# EAGLE design Cube-Panel (EAGLE 7.7.0)
Assembly variants: P1, P2, P3, P4, P5, P6
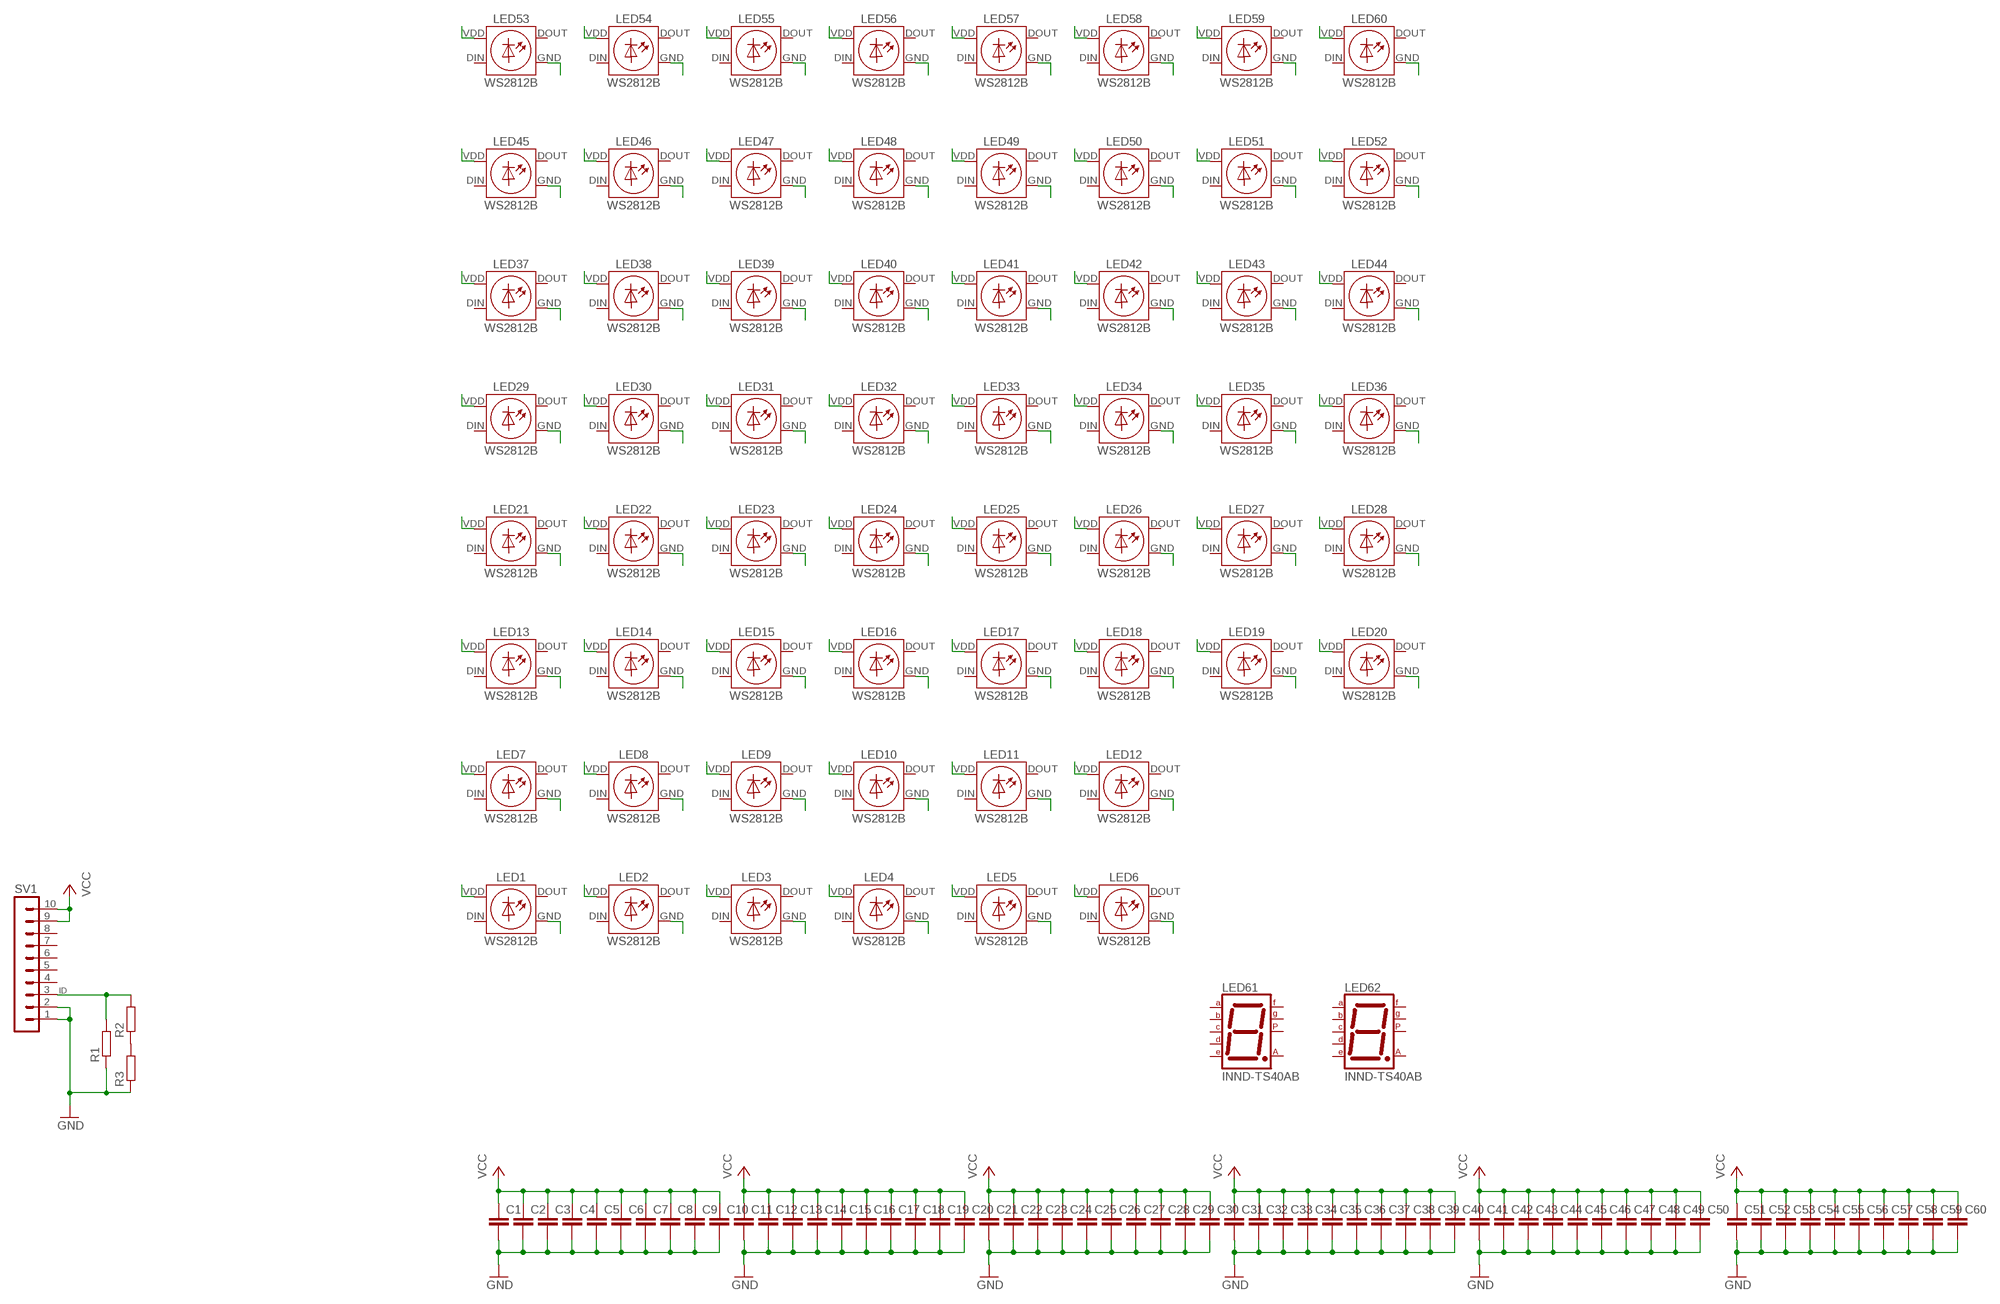
[diagram p0: schematic, sheet 1]

## Parts
C1  KONDENSATOR-0603  [0603]
C2  KONDENSATOR-0603  [0603]
C3  KONDENSATOR-0603  [0603]
C4  KONDENSATOR-0603  [0603]
C5  KONDENSATOR-0603  [0603]
C6  KONDENSATOR-0603  [0603]
C7  KONDENSATOR-0603  [0603]
C8  KONDENSATOR-0603  [0603]
C9  KONDENSATOR-0603  [0603]
C10  KONDENSATOR-0603  [0603]
C11  KONDENSATOR-0603  [0603]
C12  KONDENSATOR-0603  [0603]
C13  KONDENSATOR-0603  [0603]
C14  KONDENSATOR-0603  [0603]
C15  KONDENSATOR-0603  [0603]
C16  KONDENSATOR-0603  [0603]
C17  KONDENSATOR-0603  [0603]
C18  KONDENSATOR-0603  [0603]
C19  KONDENSATOR-0603  [0603]
C20  KONDENSATOR-0603  [0603]
C21  KONDENSATOR-0603  [0603]
C22  KONDENSATOR-0603  [0603]
C23  KONDENSATOR-0603  [0603]
C24  KONDENSATOR-0603  [0603]
C25  KONDENSATOR-0603  [0603]
C26  KONDENSATOR-0603  [0603]
C27  KONDENSATOR-0603  [0603]
C28  KONDENSATOR-0603  [0603]
C29  KONDENSATOR-0603  [0603]
C30  KONDENSATOR-0603  [0603]
C31  KONDENSATOR-0603  [0603]
C32  KONDENSATOR-0603  [0603]
C33  KONDENSATOR-0603  [0603]
C34  KONDENSATOR-0603  [0603]
C35  KONDENSATOR-0603  [0603]
C36  KONDENSATOR-0603  [0603]
C37  KONDENSATOR-0603  [0603]
C38  KONDENSATOR-0603  [0603]
C39  KONDENSATOR-0603  [0603]
C40  KONDENSATOR-0603  [0603]
C41  KONDENSATOR-0603  [0603]
C42  KONDENSATOR-0603  [0603]
C43  KONDENSATOR-0603  [0603]
C44  KONDENSATOR-0603  [0603]
C45  KONDENSATOR-0603  [0603]
C46  KONDENSATOR-0603  [0603]
C47  KONDENSATOR-0603  [0603]
C48  KONDENSATOR-0603  [0603]
C49  KONDENSATOR-0603  [0603]
C50  KONDENSATOR-0603  [0603]
C51  KONDENSATOR-0603  [0603]
C52  KONDENSATOR-0603  [0603]
C53  KONDENSATOR-0603  [0603]
C54  KONDENSATOR-0603  [0603]
C55  KONDENSATOR-0603  [0603]
C56  KONDENSATOR-0603  [0603]
C57  KONDENSATOR-0603  [0603]
C58  KONDENSATOR-0603  [0603]
C59  KONDENSATOR-0603  [0603]
C60  KONDENSATOR-0603  [0603]
LED1  WS2812B  [WS2812B]  (not fitted in variant P1)  (not fitted in variant P2)  (not fitted in variant P3)  (not fitted in variant P4)  (not fitted in variant P5)  (not fitted in variant P6)
LED2  WS2812B  [WS2812B]  (not fitted in variant P1)  (not fitted in variant P2)  (not fitted in variant P3)  (not fitted in variant P4)  (not fitted in variant P5)  (not fitted in variant P6)
LED3  WS2812B  [WS2812B]  (not fitted in variant P1)  (not fitted in variant P2)  (not fitted in variant P5)  (not fitted in variant P6)  (not fitted in variant P4)
LED4  WS2812B  [WS2812B]  (not fitted in variant P1)  (not fitted in variant P2)  (not fitted in variant P3)  (not fitted in variant P4)  (not fitted in variant P5)  (not fitted in variant P6)
LED5  WS2812B  [WS2812B]  (not fitted in variant P1)  (not fitted in variant P2)  (not fitted in variant P3)  (not fitted in variant P6)
LED6  WS2812B  [WS2812B]  (not fitted in variant P1)  (not fitted in variant P2)  (not fitted in variant P3)  (not fitted in variant P4)  (not fitted in variant P5)  (not fitted in variant P6)
LED7  WS2812B  [WS2812B]  (not fitted in variant P1)  (not fitted in variant P2)  (not fitted in variant P3)  (not fitted in variant P4)  (not fitted in variant P5)  (not fitted in variant P6)
LED8  WS2812B  [WS2812B]  (not fitted in variant P1)  (not fitted in variant P2)  (not fitted in variant P3)  (not fitted in variant P4)  (not fitted in variant P5)  (not fitted in variant P6)
LED9  WS2812B  [WS2812B]  (not fitted in variant P1)  (not fitted in variant P2)  (not fitted in variant P5)  (not fitted in variant P6)  (not fitted in variant P4)
LED10  WS2812B  [WS2812B]  (not fitted in variant P1)  (not fitted in variant P2)  (not fitted in variant P3)  (not fitted in variant P4)  (not fitted in variant P5)  (not fitted in variant P6)
LED11  WS2812B  [WS2812B]  (not fitted in variant P1)  (not fitted in variant P2)  (not fitted in variant P3)  (not fitted in variant P6)
LED12  WS2812B  [WS2812B]  (not fitted in variant P1)  (not fitted in variant P2)  (not fitted in variant P3)  (not fitted in variant P4)  (not fitted in variant P5)  (not fitted in variant P6)
LED13  WS2812B  [WS2812B]  (not fitted in variant P1)  (not fitted in variant P3)  (not fitted in variant P4)  (not fitted in variant P5)  (not fitted in variant P6)
LED14  WS2812B  [WS2812B]  (not fitted in variant P1)  (not fitted in variant P3)  (not fitted in variant P4)  (not fitted in variant P5)  (not fitted in variant P6)
LED15  WS2812B  [WS2812B]  (not fitted in variant P1)  (not fitted in variant P5)  (not fitted in variant P6)  (not fitted in variant P4)
LED16  WS2812B  [WS2812B]  (not fitted in variant P1)  (not fitted in variant P5)  (not fitted in variant P6)  (not fitted in variant P4)
LED17  WS2812B  [WS2812B]  (not fitted in variant P1)  (not fitted in variant P6)
LED18  WS2812B  [WS2812B]  (not fitted in variant P2)  (not fitted in variant P3)  (not fitted in variant P4)  (not fitted in variant P5)  (not fitted in variant P6)
LED19  WS2812B  [WS2812B]  (not fitted in variant P2)  (not fitted in variant P3)  (not fitted in variant P4)  (not fitted in variant P5)  (not fitted in variant P6)
LED20  WS2812B  [WS2812B]  (not fitted in variant P2)  (not fitted in variant P3)  (not fitted in variant P4)  (not fitted in variant P5)  (not fitted in variant P6)
LED21  WS2812B  [WS2812B]  (not fitted in variant P1)  (not fitted in variant P2)  (not fitted in variant P3)  (not fitted in variant P4)  (not fitted in variant P6)
LED22  WS2812B  [WS2812B]  (not fitted in variant P1)  (not fitted in variant P2)  (not fitted in variant P3)  (not fitted in variant P4)
LED23  WS2812B  [WS2812B]  (not fitted in variant P1)  (not fitted in variant P2)  (not fitted in variant P3)  (not fitted in variant P4)  (not fitted in variant P5)
LED24  WS2812B  [WS2812B]  (not fitted in variant P1)  (not fitted in variant P2)  (not fitted in variant P3)  (not fitted in variant P4)  (not fitted in variant P5)
LED25  WS2812B  [WS2812B]  (not fitted in variant P1)
LED26  WS2812B  [WS2812B]  (not fitted in variant P2)  (not fitted in variant P3)  (not fitted in variant P5)
LED27  WS2812B  [WS2812B]  (not fitted in variant P1)  (not fitted in variant P2)  (not fitted in variant P3)  (not fitted in variant P5)
LED28  WS2812B  [WS2812B]  (not fitted in variant P1)  (not fitted in variant P2)  (not fitted in variant P3)  (not fitted in variant P5)
LED29  WS2812B  [WS2812B]  (not fitted in variant P2)  (not fitted in variant P3)  (not fitted in variant P5)  (not fitted in variant P6)  (not fitted in variant P4)
LED30  WS2812B  [WS2812B]  (not fitted in variant P2)  (not fitted in variant P3)  (not fitted in variant P4)
LED31  WS2812B  [WS2812B]  (not fitted in variant P2)  (not fitted in variant P3)  (not fitted in variant P4)  (not fitted in variant P5)  (not fitted in variant P6)
LED32  WS2812B  [WS2812B]  (not fitted in variant P2)  (not fitted in variant P3)  (not fitted in variant P4)  (not fitted in variant P5)  (not fitted in variant P6)
LED33  WS2812B  [WS2812B]  (not fitted in variant P6)  (not fitted in variant P4)
LED34  WS2812B  [WS2812B]  (not fitted in variant P2)  (not fitted in variant P3)  (not fitted in variant P4)  (not fitted in variant P5)  (not fitted in variant P6)
LED35  WS2812B  [WS2812B]  (not fitted in variant P1)  (not fitted in variant P2)  (not fitted in variant P3)  (not fitted in variant P4)  (not fitted in variant P5)  (not fitted in variant P6)
LED36  WS2812B  [WS2812B]  (not fitted in variant P1)  (not fitted in variant P2)  (not fitted in variant P3)  (not fitted in variant P4)  (not fitted in variant P5)  (not fitted in variant P6)
LED37  WS2812B  [WS2812B]  (not fitted in variant P1)  (not fitted in variant P2)  (not fitted in variant P3)  (not fitted in variant P4)  (not fitted in variant P5)  (not fitted in variant P6)
LED38  WS2812B  [WS2812B]  (not fitted in variant P1)  (not fitted in variant P2)  (not fitted in variant P3)  (not fitted in variant P4)
LED39  WS2812B  [WS2812B]  (not fitted in variant P1)  (not fitted in variant P5)  (not fitted in variant P4)  (not fitted in variant P3)
LED40  WS2812B  [WS2812B]  (not fitted in variant P1)  (not fitted in variant P5)  (not fitted in variant P4)  (not fitted in variant P3)
LED41  WS2812B  [WS2812B]  (not fitted in variant P1)  (not fitted in variant P4)
LED42  WS2812B  [WS2812B]  (not fitted in variant P1)  (not fitted in variant P2)  (not fitted in variant P3)  (not fitted in variant P4)  (not fitted in variant P5)  (not fitted in variant P6)
LED43  WS2812B  [WS2812B]  (not fitted in variant P1)  (not fitted in variant P2)  (not fitted in variant P3)  (not fitted in variant P4)  (not fitted in variant P5)  (not fitted in variant P6)
LED44  WS2812B  [WS2812B]  (not fitted in variant P1)  (not fitted in variant P2)  (not fitted in variant P3)  (not fitted in variant P4)  (not fitted in variant P5)  (not fitted in variant P6)
LED45  WS2812B  [WS2812B]  (not fitted in variant P1)  (not fitted in variant P2)  (not fitted in variant P3)  (not fitted in variant P4)  (not fitted in variant P5)  (not fitted in variant P6)
LED46  WS2812B  [WS2812B]  (not fitted in variant P1)  (not fitted in variant P2)  (not fitted in variant P3)  (not fitted in variant P4)  (not fitted in variant P6)
LED47  WS2812B  [WS2812B]  (not fitted in variant P1)  (not fitted in variant P6)  (not fitted in variant P3)  (not fitted in variant P4)
LED48  WS2812B  [WS2812B]  (not fitted in variant P1)  (not fitted in variant P2)  (not fitted in variant P3)  (not fitted in variant P4)  (not fitted in variant P6)
LED49  WS2812B  [WS2812B]  (not fitted in variant P1)  (not fitted in variant P2)  (not fitted in variant P4)
LED50  WS2812B  [WS2812B]  (not fitted in variant P1)  (not fitted in variant P2)  (not fitted in variant P3)  (not fitted in variant P4)  (not fitted in variant P5)  (not fitted in variant P6)
LED51  WS2812B  [WS2812B]  (not fitted in variant P1)  (not fitted in variant P2)  (not fitted in variant P3)  (not fitted in variant P4)  (not fitted in variant P5)  (not fitted in variant P6)
LED52  WS2812B  [WS2812B]  (not fitted in variant P1)  (not fitted in variant P2)  (not fitted in variant P3)  (not fitted in variant P4)  (not fitted in variant P5)  (not fitted in variant P6)
LED53  WS2812B  [WS2812B]  (not fitted in variant P1)  (not fitted in variant P2)  (not fitted in variant P3)  (not fitted in variant P4)  (not fitted in variant P5)  (not fitted in variant P6)
LED54  WS2812B  [WS2812B]  (not fitted in variant P1)  (not fitted in variant P2)  (not fitted in variant P3)  (not fitted in variant P4)  (not fitted in variant P5)  (not fitted in variant P6)
LED55  WS2812B  [WS2812B]  (not fitted in variant P1)  (not fitted in variant P5)  (not fitted in variant P6)  (not fitted in variant P3)  (not fitted in variant P4)
LED56  WS2812B  [WS2812B]  (not fitted in variant P1)  (not fitted in variant P2)  (not fitted in variant P3)  (not fitted in variant P4)  (not fitted in variant P5)  (not fitted in variant P6)
LED57  WS2812B  [WS2812B]  (not fitted in variant P1)  (not fitted in variant P2)  (not fitted in variant P4)  (not fitted in variant P5)
LED58  WS2812B  [WS2812B]  (not fitted in variant P1)  (not fitted in variant P2)  (not fitted in variant P3)  (not fitted in variant P4)  (not fitted in variant P5)  (not fitted in variant P6)
LED59  WS2812B  [WS2812B]  (not fitted in variant P1)  (not fitted in variant P2)  (not fitted in variant P3)  (not fitted in variant P4)  (not fitted in variant P5)  (not fitted in variant P6)
LED60  WS2812B  [WS2812B]  (not fitted in variant P1)  (not fitted in variant P2)  (not fitted in variant P3)  (not fitted in variant P4)  (not fitted in variant P5)  (not fitted in variant P6)
LED61  INND-TS40AB  [7SEG-13]
LED62  INND-TS40AB  [7SEG-13]
R1  WIDERSTAND_0603  [R0603]
R2  WIDERSTAND_0603  [R0603]
R3  WIDERSTAND_0603  [R0603]
SV1  MA10-1  [MA10-1]

## Nets
GND: C1.P$2 C2.P$2 C3.P$2 C4.P$2 C5.P$2 C6.P$2 C7.P$2 C8.P$2 C9.P$2 C10.P$2 C11.P$2 C12.P$2 C13.P$2 C14.P$2 C15.P$2 C16.P$2 C17.P$2 C18.P$2 C19.P$2 C20.P$2 C21.P$2 C22.P$2 C23.P$2 C24.P$2 C25.P$2 C26.P$2 C27.P$2 C28.P$2 C29.P$2 C30.P$2 C31.P$2 C32.P$2 C33.P$2 C34.P$2 C35.P$2 C36.P$2 C37.P$2 C38.P$2 C39.P$2 C40.P$2 C41.P$2 C42.P$2 C43.P$2 C44.P$2 C45.P$2 C46.P$2 C47.P$2 C48.P$2 C49.P$2 C50.P$2 C51.P$2 C52.P$2 C53.P$2 C54.P$2 C55.P$2 C56.P$2 C57.P$2 C58.P$2 C59.P$2 C60.P$2 LED1.GND LED2.GND LED3.GND LED4.GND LED5.GND LED6.GND LED7.GND LED8.GND LED9.GND LED10.GND LED11.GND LED12.GND LED13.GND LED14.GND LED15.GND LED16.GND LED17.GND LED18.GND LED19.GND LED20.GND LED21.GND LED22.GND LED23.GND LED24.GND LED25.GND LED26.GND LED27.GND LED28.GND LED29.GND LED30.GND LED31.GND LED32.GND LED33.GND LED34.GND LED35.GND LED36.GND LED37.GND LED38.GND LED39.GND LED40.GND LED41.GND LED42.GND LED43.GND LED44.GND LED45.GND LED46.GND LED47.GND LED48.GND LED49.GND LED50.GND LED51.GND LED52.GND LED53.GND LED54.GND LED55.GND LED56.GND LED57.GND LED58.GND LED59.GND LED60.GND R1.1 R3.1 SV1.1 SV1.2
ID: R1.2 R2.2 SV1.3
N$1: R2.1 R3.2
VCC: C1.P$1 C2.P$1 C3.P$1 C4.P$1 C5.P$1 C6.P$1 C7.P$1 C8.P$1 C9.P$1 C10.P$1 C11.P$1 C12.P$1 C13.P$1 C14.P$1 C15.P$1 C16.P$1 C17.P$1 C18.P$1 C19.P$1 C20.P$1 C21.P$1 C22.P$1 C23.P$1 C24.P$1 C25.P$1 C26.P$1 C27.P$1 C28.P$1 C29.P$1 C30.P$1 C31.P$1 C32.P$1 C33.P$1 C34.P$1 C35.P$1 C36.P$1 C37.P$1 C38.P$1 C39.P$1 C40.P$1 C41.P$1 C42.P$1 C43.P$1 C44.P$1 C45.P$1 C46.P$1 C47.P$1 C48.P$1 C49.P$1 C50.P$1 C51.P$1 C52.P$1 C53.P$1 C54.P$1 C55.P$1 C56.P$1 C57.P$1 C58.P$1 C59.P$1 C60.P$1 LED1.VDD(VCC) LED2.VDD(VCC) LED3.VDD(VCC) LED4.VDD(VCC) LED5.VDD(VCC) LED6.VDD(VCC) LED7.VDD(VCC) LED8.VDD(VCC) LED9.VDD(VCC) LED10.VDD(VCC) LED11.VDD(VCC) LED12.VDD(VCC) LED13.VDD(VCC) LED14.VDD(VCC) LED15.VDD(VCC) LED16.VDD(VCC) LED17.VDD(VCC) LED18.VDD(VCC) LED19.VDD(VCC) LED20.VDD(VCC) LED21.VDD(VCC) LED22.VDD(VCC) LED23.VDD(VCC) LED24.VDD(VCC) LED25.VDD(VCC) LED26.VDD(VCC) LED27.VDD(VCC) LED28.VDD(VCC) LED29.VDD(VCC) LED30.VDD(VCC) LED31.VDD(VCC) LED32.VDD(VCC) LED33.VDD(VCC) LED34.VDD(VCC) LED35.VDD(VCC) LED36.VDD(VCC) LED37.VDD(VCC) LED38.VDD(VCC) LED39.VDD(VCC) LED40.VDD(VCC) LED41.VDD(VCC) LED42.VDD(VCC) LED43.VDD(VCC) LED44.VDD(VCC) LED45.VDD(VCC) LED46.VDD(VCC) LED47.VDD(VCC) LED48.VDD(VCC) LED49.VDD(VCC) LED50.VDD(VCC) LED51.VDD(VCC) LED52.VDD(VCC) LED53.VDD(VCC) LED54.VDD(VCC) LED55.VDD(VCC) LED56.VDD(VCC) LED57.VDD(VCC) LED58.VDD(VCC) LED59.VDD(VCC) LED60.VDD(VCC) SV1.9 SV1.10
Unconnected: LED1.DIN LED1.DOUT LED2.DIN LED2.DOUT LED3.DIN LED3.DOUT LED4.DIN LED4.DOUT LED5.DIN LED5.DOUT LED6.DIN LED6.DOUT LED7.DIN LED7.DOUT LED8.DIN LED8.DOUT LED9.DIN LED9.DOUT LED10.DIN LED10.DOUT LED11.DIN LED11.DOUT LED12.DIN LED12.DOUT LED13.DIN LED13.DOUT LED14.DIN LED14.DOUT LED15.DIN LED15.DOUT LED16.DIN LED16.DOUT LED17.DIN LED17.DOUT LED18.DIN LED18.DOUT LED19.DIN LED19.DOUT LED20.DIN LED20.DOUT LED21.DIN LED21.DOUT LED22.DIN LED22.DOUT LED23.DIN LED23.DOUT LED24.DIN LED24.DOUT LED25.DIN LED25.DOUT LED26.DIN LED26.DOUT LED27.DIN LED27.DOUT LED28.DIN LED28.DOUT LED29.DIN LED29.DOUT LED30.DIN LED30.DOUT LED31.DIN LED31.DOUT LED32.DIN LED32.DOUT LED33.DIN LED33.DOUT LED34.DIN LED34.DOUT LED35.DIN LED35.DOUT LED36.DIN LED36.DOUT LED37.DIN LED37.DOUT LED38.DIN LED38.DOUT LED39.DIN LED39.DOUT LED40.DIN LED40.DOUT LED41.DIN LED41.DOUT LED42.DIN LED42.DOUT LED43.DIN LED43.DOUT LED44.DIN LED44.DOUT LED45.DIN LED45.DOUT LED46.DIN LED46.DOUT LED47.DIN LED47.DOUT LED48.DIN LED48.DOUT LED49.DIN LED49.DOUT LED50.DIN LED50.DOUT LED51.DIN LED51.DOUT LED52.DIN LED52.DOUT LED53.DIN LED53.DOUT LED54.DIN LED54.DOUT LED55.DIN LED55.DOUT LED56.DIN LED56.DOUT LED57.DIN LED57.DOUT LED58.DIN LED58.DOUT LED59.DIN LED59.DOUT LED60.DIN LED60.DOUT LED61.1(E) LED61.2(F) LED61.3(G) LED61.5(D) LED61.6(CA2) LED61.7(DP) LED61.8(C) LED61.9(B) LED61.10(A) LED62.1(E) LED62.2(F) LED62.3(G) LED62.5(D) LED62.6(CA2) LED62.7(DP) LED62.8(C) LED62.9(B) LED62.10(A) SV1.4 SV1.5 SV1.6 SV1.7 SV1.8

## Library data of the parts
C1-C60 = _Passive:KONDENSATOR; PDP_NAME: Keramikkondensator, 0603, %VALUE%
LED1-LED60 = _LED:WS2812
LED61 LED62 = _LED:INND-TS40*AB
R1-R3 = _Passive:WIDERSTAND
SV1 = con-lstb:MA10-1: PIN HEADER; OC_FARNELL: unknown; OC_NEWARK: unknown

## Board
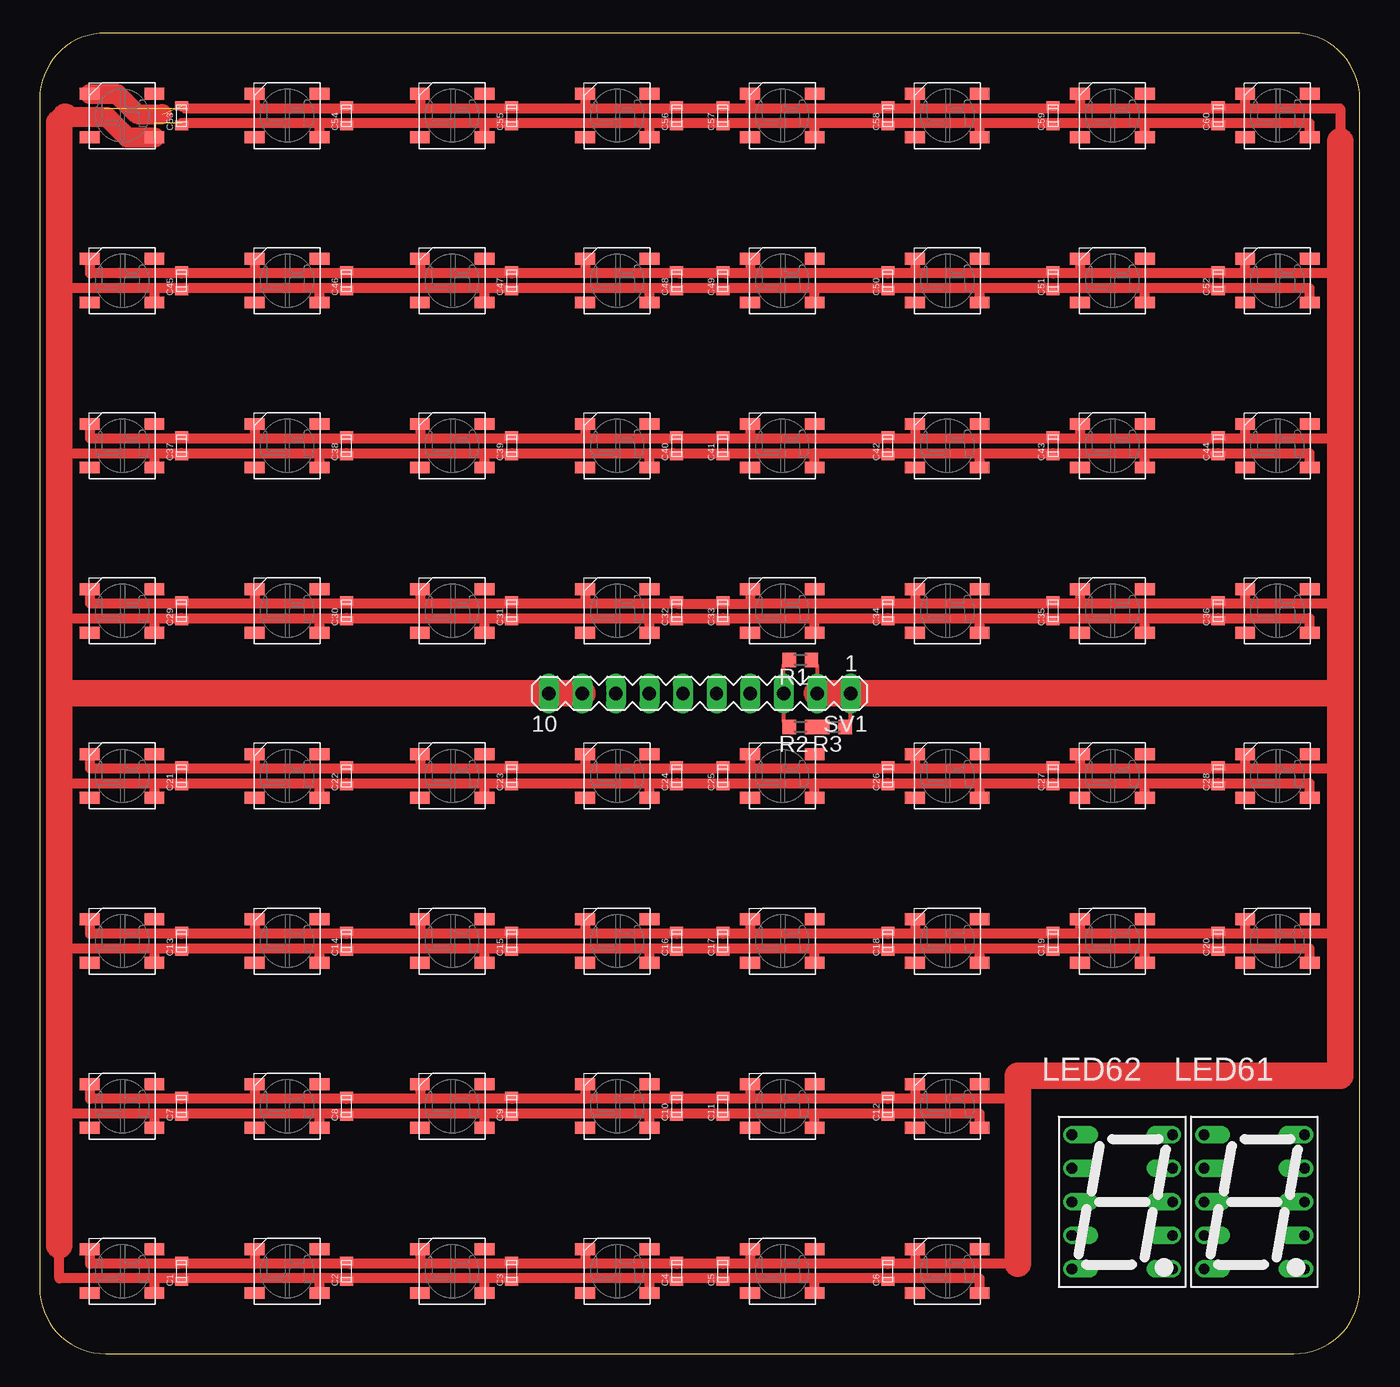
[diagram p1: board, top side]

Size 100 x 100 mm. Coordinates in mm from the lower left corner, seen from the top.
Outline: 5,0 95,0 arc90 100,5 100,95 arc90 95,100 5,100 arc90 0,95 0,5 arc90 5,0
Copper layers (1*16): Top 0.035mm / dielectric 1.5mm / Bottom 0.035mm
Design rules "default *": minimum track width 10mil, minimum drill 24mil, track to track 8mil, track to pad 8mil, pad to pad 8mil, via to via 8mil, smd to smd 8mil, copper to edge 0.5mm, drill to drill 8mil, minimum pad ring 10mil, minimum via ring 8mil, stop-mask expansion 4mil, vias tented up to drill 0mil, thermal gap 10mil

### Footprints (pad centres in the part's own frame; a part is rotated, then mirrored left to right if it is on the bottom)
0603 = smd 0.7 x 1: P$1 -0.75,0; P$2 0.75,0
WS2812B = smd 1.5 x 0.9: DIN 2.45,1.65; DOUT -2.45,-1.65; GND 2.45,-1.65; VDD -2.45,1.65
7SEG-13 = drill 0.813 offset: 1 -3.81,5.08; 2 -3.81,2.54; 3 -3.81,0; 4 -3.81,-2.54; 5 -3.81,-5.08; 6 3.81,-5.08; 7 3.81,-2.54; 8 3.81,0; 9 3.81,2.54; 10 3.81,5.08
R0603 = smd 1 x 1.1: 1 -0.85,0; 2 0.85,0
MA10-1 = drill 1.016 long: 1 -11.43,0; 2 -8.89,0; 3 -6.35,0; 4 -3.81,0; 5 -1.27,0; 6 1.27,0; 7 3.81,0; 8 6.35,0; 9 8.89,0; 10 11.43,0

### Placement (x,y rotation side)
C1  10.75,6.25 90 top
C2  23.25,6.25 90 top
C3  35.75,6.25 90 top
C4  48.25,6.25 90 top
C5  51.75,6.25 90 top
C6  64.25,6.25 90 top
C7  10.75,18.75 90 top
C8  23.25,18.75 90 top
C9  35.75,18.75 90 top
C10  48.25,18.75 90 top
C11  51.75,18.75 90 top
C12  64.25,18.75 90 top
C13  10.75,31.25 90 top
C14  23.25,31.25 90 top
C15  35.75,31.25 90 top
C16  48.25,31.25 90 top
C17  51.75,31.25 90 top
C18  64.25,31.25 90 top
C19  76.75,31.25 90 top
C20  89.25,31.25 90 top
C21  10.75,43.75 90 top
C22  23.25,43.75 90 top
C23  35.75,43.75 90 top
C24  48.25,43.75 90 top
C25  51.75,43.75 90 top
C26  64.25,43.75 90 top
C27  76.75,43.75 90 top
C28  89.25,43.75 90 top
C29  10.75,56.25 90 top
C30  23.25,56.25 90 top
C31  35.75,56.25 90 top
C32  48.25,56.25 90 top
C33  51.75,56.25 90 top
C34  64.25,56.25 90 top
C35  76.75,56.25 90 top
C36  89.25,56.25 90 top
C37  10.75,68.75 90 top
C38  23.25,68.75 90 top
C39  35.75,68.75 90 top
C40  48.25,68.75 90 top
C41  51.75,68.75 90 top
C42  64.25,68.75 90 top
C43  76.75,68.75 90 top
C44  89.25,68.75 90 top
C45  10.75,81.25 90 top
C46  23.25,81.25 90 top
C47  35.75,81.25 90 top
C48  48.25,81.25 90 top
C49  51.75,81.25 90 top
C50  64.25,81.25 90 top
C51  76.75,81.25 90 top
C52  89.25,81.25 90 top
C53  10.75,93.75 90 top
C54  23.25,93.75 90 top
C55  35.75,93.75 90 top
C56  48.25,93.75 90 top
C57  51.75,93.75 90 top
C58  64.25,93.75 90 top
C59  76.75,93.75 90 top
C60  89.25,93.75 90 top
LED1  6.25,6.25 180 top
LED2  18.75,6.25 180 top
LED3  31.25,6.25 180 top
LED4  43.75,6.25 180 top
LED5  56.25,6.25 180 top
LED6  68.75,6.25 180 top
LED7  6.25,18.75 180 top
LED8  18.75,18.75 180 top
LED9  31.25,18.75 180 top
LED10  43.75,18.75 180 top
LED11  56.25,18.75 180 top
LED12  68.75,18.75 180 top
LED13  6.25,31.25 180 top
LED14  18.75,31.25 180 top
LED15  31.25,31.25 180 top
LED16  43.75,31.25 180 top
LED17  56.25,31.25 180 top
LED18  68.75,31.25 180 top
LED19  81.25,31.25 180 top
LED20  93.75,31.25 180 top
LED21  6.25,43.75 180 top
LED22  18.75,43.75 180 top
LED23  31.25,43.75 180 top
LED24  43.75,43.75 180 top
LED25  56.25,43.75 180 top
LED26  68.75,43.75 180 top
LED27  81.25,43.75 180 top
LED28  93.75,43.75 180 top
LED29  6.25,56.25 180 top
LED30  18.75,56.25 180 top
LED31  31.25,56.25 180 top
LED32  43.75,56.25 180 top
LED33  56.25,56.25 180 top
LED34  68.75,56.25 180 top
LED35  81.25,56.25 180 top
LED36  93.75,56.25 180 top
LED37  6.25,68.75 180 top
LED38  18.75,68.75 180 top
LED39  31.25,68.75 180 top
LED40  43.75,68.75 180 top
LED41  56.25,68.75 180 top
LED42  68.75,68.75 180 top
LED43  81.25,68.75 180 top
LED44  93.75,68.75 180 top
LED45  6.25,81.25 180 top
LED46  18.75,81.25 180 top
LED47  31.25,81.25 180 top
LED48  43.75,81.25 180 top
LED49  56.25,81.25 180 top
LED50  68.75,81.25 180 top
LED51  81.25,81.25 180 top
LED52  93.75,81.25 180 top
LED53  6.25,93.75 180 top
LED54  18.75,93.75 180 top
LED55  31.25,93.75 180 top
LED56  43.75,93.75 180 top
LED57  56.25,93.75 180 top
LED58  68.75,93.75 180 top
LED59  81.25,93.75 180 top
LED60  93.75,93.75 180 top
LED61  92,11.5 0 top
LED62  82,11.5 0 top
R1  57.62,52.54 180 top
R2  57.62,47.46 180 top
R3  60.16,47.46 180 top
SV1  50,50 180 top

### Tracks (layer width: path | path; a pad name or v marks a point on that pad's centre or on a via)
GND  (3 unrouted)
  Top 0.3: R1.1 58.89,52.12 SV1.2 | R3.1 61.43,47.88 SV1.1
  Top 0.5: C6.P$2 64.25,6.8 | C5.P$2 51.75,6.8 | C4.P$2 48.25,6.8 | C3.P$2 35.75,6.8 35.5,6.8 | C2.P$2 23.25,6.8 23.5,6.8 | C1.P$2 10.75,6.8 10.5,6.8 | C7.P$2 10.75,19.3 | C8.P$2 23.25,19.3 | C9.P$2 35.75,19.3 | C10.P$2 48.25,19.3 | C11.P$2 51.75,19.3 52,19.3 | C12.P$2 64.25,19.3 | C20.P$2 89.25,31.8 | C19.P$2 76.75,31.8 76.5,31.8 | C18.P$2 64.25,31.8 | C17.P$2 51.75,31.8 | C16.P$2 48.25,31.8 | C15.P$2 35.75,31.8 35.5,31.8 | C14.P$2 23.25,31.8 | C13.P$2 10.75,31.8 | C21.P$2 10.75,44.3 | C22.P$2 23.25,44.3 | C23.P$2 35.75,44.3 36,44.3 | C24.P$2 48.25,44.3 48.5,44.3 | C25.P$2 51.75,44.3 52,44.3 | C26.P$2 64.25,44.3 | C27.P$2 76.75,44.3 | C28.P$2 89.25,44.3 | C36.P$2 89.25,56.8 | C35.P$2 76.75,56.8 76.5,56.8 | C34.P$2 64.25,56.8 | C32.P$2 48.25,56.8 | C31.P$2 35.75,56.8 35.25,56.8 | C30.P$2 23.25,56.8 | C29.P$2 10.75,56.8 10.5,56.8 | C37.P$2 10.75,69.3 | C38.P$2 23.25,69.3 | C39.P$2 35.75,69.3 36,69.3 | C40.P$2 48.25,69.3 | C41.P$2 51.75,69.3 52,69.3 | C42.P$2 64.25,69.3 64.5,69.3 | C43.P$2 76.75,69.3 | C44.P$2 89.25,69.3 89.5,69.3 | C52.P$2 89.25,81.8 89.5,81.8 | C51.P$2 76.75,81.8 | C50.P$2 64.25,81.8 | C49.P$2 51.75,81.8 52,81.8 | C48.P$2 48.25,81.8 48.5,81.8 | C47.P$2 35.75,81.8 | C46.P$2 23.25,81.8 22.75,81.8 | C45.P$2 10.75,81.8 | C53.P$2 10.75,94.3 11,94.3 | C54.P$2 23.25,94.3 23.5,94.3 | C55.P$2 35.75,94.3 | C56.P$2 48.25,94.3 | C57.P$2 51.75,94.3 | C58.P$2 64.25,94.3 | C59.P$2 76.75,94.3 | C60.P$2 89.25,94.3 | C33.P$2 51.75,56.8
  Top 0.75: 11,94.3 16.3,94.3 | 16.3,94.3 23.5,94.3 28.8,94.3 | 28.8,94.3 35.75,94.3 41.3,94.3 | 41.3,94.3 48.25,94.3 51.75,94.3 53.8,94.3 | 53.8,94.3 64.25,94.3 66.3,94.3 | 66.3,94.3 76.75,94.3 78.8,94.3 | 78.8,94.3 89.25,94.3 91.3,94.3 | 91.3,94.3 98.5,94.3 98.5,91.8 | 98.5,81.8 91.3,81.8 | 91.3,81.8 89.5,81.8 78.8,81.8 | 78.8,81.8 76.75,81.8 66.3,81.8 | 66.3,81.8 64.25,81.8 53.8,81.8 | 53.8,81.8 52,81.8 48.5,81.8 41.3,81.8 | 41.3,81.8 35.75,81.8 28.8,81.8 | 28.8,81.8 22.75,81.8 16.3,81.8 | 16.3,81.8 10.75,81.8 3.8,81.8 LED45.GND | 16.3,69.3 10.75,69.3 3.8,69.3 LED37.GND | 16.3,69.3 23.25,69.3 28.8,69.3 | 28.8,69.3 36,69.3 41.3,69.3 | 41.3,69.3 48.25,69.3 52,69.3 53.8,69.3 | 53.8,69.3 64.5,69.3 66.3,69.3 | 66.3,69.3 76.75,69.3 78.8,69.3 | 78.8,69.3 89.5,69.3 91.3,69.3 | 91.3,69.3 98.5,69.3 | 98.5,56.8 91.3,56.8 | 91.3,56.8 89.25,56.8 78.8,56.8 | 78.8,56.8 76.5,56.8 66.3,56.8 | 66.3,56.8 64.25,56.8 53.8,56.8 | 41.3,56.8 48.25,56.8 51.75,56.8 53.8,56.8 | 41.3,56.8 35.25,56.8 28.8,56.8 | 28.8,56.8 23.25,56.8 16.3,56.8 | 16.3,56.8 10.5,56.8 3.8,56.8 LED29.GND | 98.5,44.3 91.3,44.3 | 91.3,44.3 89.25,44.3 78.8,44.3 | 78.8,44.3 76.75,44.3 66.3,44.3 | 66.3,44.3 64.25,44.3 53.8,44.3 | 53.8,44.3 52,44.3 48.5,44.3 41.3,44.3 | 41.3,44.3 36,44.3 28.8,44.3 | 28.8,44.3 23.25,44.3 16.3,44.3 | 16.3,44.3 10.75,44.3 3.8,44.3 LED21.GND | 98.5,31.8 91.3,31.8 | 91.3,31.8 89.25,31.8 78.8,31.8 | 78.8,31.8 76.5,31.8 66.3,31.8 | 66.3,31.8 64.25,31.8 53.8,31.8 | 53.8,31.8 51.75,31.8 48.25,31.8 41.3,31.8 | 41.3,31.8 35.5,31.8 28.8,31.8 | 28.8,31.8 23.25,31.8 16.3,31.8 | 16.3,31.8 10.75,31.8 3.8,31.8 LED13.GND | 74.1,19.3 66.3,19.3 | 66.3,19.3 64.25,19.3 53.8,19.3
  Top 0.75: 53.8,19.3 52,19.3 48.25,19.3 41.3,19.3 | 41.3,19.3 35.75,19.3 28.8,19.3 | 28.8,19.3 23.25,19.3 16.3,19.3 | 16.3,19.3 10.75,19.3 3.8,19.3 LED7.GND | 74.1,6.8 66.3,6.8 | 66.3,6.8 64.25,6.8 53.8,6.8 | 53.8,6.8 51.75,6.8 48.25,6.8 41.3,6.8 | 41.3,6.8 35.5,6.8 28.8,6.8 | 28.8,6.8 23.5,6.8 16.3,6.8 | 16.3,6.8 10.5,6.8 3.8,6.8 LED1.GND | LED19.GND 78.8,31.8 | LED20.GND 91.3,31.8 | LED18.GND 66.3,31.8 | LED17.GND 53.8,31.8 | LED16.GND 41.3,31.8 | LED15.GND 28.8,31.8 | LED14.GND 16.3,31.8 | LED8.GND 16.3,19.3 | LED9.GND 28.8,19.3 | LED10.GND 41.3,19.3 | LED11.GND 53.8,19.3 | LED12.GND 66.3,19.3 | LED6.GND 66.3,6.8 | LED5.GND 53.8,6.8 | LED4.GND 41.3,6.8 | LED3.GND 28.8,6.8 | LED2.GND 16.3,6.8 | LED22.GND 16.3,44.3 | LED23.GND 28.8,44.3 | LED24.GND 41.3,44.3 | LED25.GND 53.8,44.3 | LED26.GND 66.3,44.3 | LED27.GND 78.8,44.3 | LED28.GND 91.3,44.3 | LED36.GND 91.3,56.8 | LED35.GND 78.8,56.8 | LED34.GND 66.3,56.8 | LED33.GND 53.8,56.8 | LED32.GND 41.3,56.8 | LED31.GND 28.8,56.8 | LED30.GND 16.3,56.8 | LED38.GND 16.3,69.3 | LED39.GND 28.8,69.3 | LED40.GND 41.3,69.3 | LED41.GND 53.8,69.3 | LED42.GND 66.3,69.3 | LED43.GND 78.8,69.3 | LED44.GND 91.3,69.3 | LED52.GND 91.3,81.8 | LED51.GND 78.8,81.8 | LED50.GND 66.3,81.8 | LED49.GND 53.8,81.8 | LED48.GND 41.3,81.8 | LED47.GND 28.8,81.8 | LED46.GND 16.3,81.8 | LED54.GND 16.3,94.3 | LED55.GND 28.8,94.3 | LED56.GND 41.3,94.3 | LED57.GND 53.8,94.3 | LED58.GND 66.3,94.3 | LED59.GND 78.8,94.3 | LED60.GND 91.3,94.3
  Top 1.5: LED53.GND 5.85,95.4 7.4,93.85 9.27,93.85
  Top 2: 98.5,91.8 98.5,81.8 98.5,69.3 98.5,56.8 98.5,50 | 98.5,50 98.5,44.3 98.5,31.8 98.5,21.05 74.1,21.05 74.1,19.3 74.1,6.8 | SV1.2 SV1.1 98.5,50
ID
  Top 0.3: R1.2 56.35,52.12 SV1.3 56.35,47.88 R2.2
N$1
  Top 0.3: R2.1 R3.2
VCC  (2 unrouted)
  Top 0.5: C6.P$1 64.25,5.7 64.5,5.7 | C5.P$1 51.75,5.7 51.5,5.7 | C4.P$1 48.25,5.7 | C3.P$1 35.75,5.7 35.5,5.7 | C2.P$1 23.25,5.7 | C1.P$1 10.75,5.7 | 10.75,18.2 C7.P$1 | C8.P$1 23.25,18.2 | C9.P$1 35.75,18.2 | C10.P$1 48.25,18.2 48.75,18.2 | C11.P$1 51.75,18.2 | C12.P$1 64.25,18.2 | C20.P$1 89.25,30.7 | C19.P$1 76.75,30.7 | C18.P$1 64.25,30.7 | C17.P$1 51.75,30.7 51.5,30.7 | C16.P$1 48.25,30.7 | C15.P$1 35.75,30.7 | C14.P$1 23.25,30.7 | C13.P$1 10.75,30.7 | C21.P$1 10.75,43.2 | C22.P$1 23.25,43.2 | C23.P$1 35.75,43.2 36,43.2 | C24.P$1 48.25,43.2 | C25.P$1 51.75,43.2 52,43.2 | C26.P$1 64.25,43.2 | C27.P$1 76.75,43.2 | C28.P$1 89.25,43.2 | C36.P$1 89.25,55.7 | C35.P$1 76.75,55.7 76.25,55.7 | C34.P$1 64.25,55.7 | C33.P$1 51.75,55.7 | C32.P$1 48.25,55.7 | C31.P$1 35.75,55.7 35.5,55.7 | C30.P$1 23.25,55.7 | C29.P$1 10.75,55.7 | C37.P$1 10.75,68.2 | C38.P$1 23.25,68.2 | C39.P$1 35.75,68.2 | C40.P$1 48.25,68.2 48,68.2 | C41.P$1 51.75,68.2 | C42.P$1 64.25,68.2 | C43.P$1 76.75,68.2 | C44.P$1 89.25,68.2 | C52.P$1 89.25,80.7 | C51.P$1 76.75,80.7 76.5,80.7 | C50.P$1 64.25,80.7 | C49.P$1 51.75,80.7 52,80.7 | C48.P$1 48.25,80.7 | C47.P$1 35.75,80.7 | C46.P$1 23.25,80.7 | C45.P$1 10.75,80.7 | C53.P$1 10.75,93.2 | C54.P$1 23.25,93.2 23.5,93.2 | C55.P$1 35.75,93.2 | C56.P$1 48.25,93.2 | C57.P$1 51.75,93.2 | C58.P$1 64.25,93.2 | C59.P$1 76.75,93.2 76.5,93.2 | C60.P$1 89.25,93.2 89.5,93.2
  Top 0.75: 10.75,93.2 21.2,93.2 | 21.2,93.2 23.5,93.2 33.7,93.2 | 33.7,93.2 35.75,93.2 46.2,93.2 | 46.2,93.2 48.25,93.2 51.75,93.2 58.7,93.2 | 58.7,93.2 64.25,93.2 71.2,93.2 | 71.2,93.2 76.5,93.2 83.7,93.2 | 83.7,93.2 89.5,93.2 96.2,93.2 LED60.VDD | 1.5,80.7 8.7,80.7 | 8.7,80.7 10.75,80.7 21.2,80.7 | 21.2,80.7 23.25,80.7 33.7,80.7 | 33.7,80.7 35.75,80.7 46.2,80.7 | 46.2,80.7 48.25,80.7 52,80.7 58.7,80.7 | 58.7,80.7 64.25,80.7 71.2,80.7 | 71.2,80.7 76.5,80.7 83.7,80.7 | 83.7,80.7 89.25,80.7 96.2,80.7 LED52.VDD | 1.5,68.2 8.7,68.2 | 8.7,68.2 10.75,68.2 21.2,68.2 | 21.2,68.2 23.25,68.2 33.7,68.2 | 33.7,68.2 35.75,68.2 46.2,68.2 | 46.2,68.2 48,68.2 51.75,68.2 58.7,68.2 | 58.7,68.2 64.25,68.2 71.2,68.2 | 71.2,68.2 76.75,68.2 83.7,68.2 | 83.7,68.2 89.25,68.2 96.2,68.2 LED44.VDD | 1.5,55.7 8.7,55.7 | 8.7,55.7 10.75,55.7 21.2,55.7 | 21.2,55.7 23.25,55.7 33.7,55.7 | 33.7,55.7 35.5,55.7 46.2,55.7 | 46.2,55.7 48.25,55.7 51.75,55.7 58.7,55.7 | 58.7,55.7 64.25,55.7 71.2,55.7 | 71.2,55.7 76.25,55.7 83.7,55.7 | 83.7,55.7 89.25,55.7 96.2,55.7 LED36.VDD | 1.5,43.2 8.7,43.2 | 8.7,43.2 10.75,43.2 21.2,43.2 | 21.2,43.2 23.25,43.2 33.7,43.2 | 33.7,43.2 36,43.2 46.2,43.2 | 46.2,43.2 48.25,43.2 52,43.2 58.7,43.2 | 58.7,43.2 64.25,43.2 71.2,43.2 | 71.2,43.2 76.75,43.2 83.7,43.2 | 83.7,43.2 89.25,43.2 96.2,43.2 LED28.VDD | 1.5,30.7 8.7,30.7 | 8.7,30.7 10.75,30.7 21.2,30.7 | 21.2,30.7 23.25,30.7 33.7,30.7 | 33.7,30.7 35.75,30.7 46.2,30.7 | 46.2,30.7 48.25,30.7 51.5,30.7 58.7,30.7 | 58.7,30.7 64.25,30.7 71.2,30.7 | 71.2,30.7 76.75,30.7 83.7,30.7 | 83.7,30.7 89.25,30.7 96.2,30.7 LED20.VDD | 1.5,18.2 8.7,18.2 | 8.7,18.2 10.75,18.2 21.2,18.2 | 21.2,18.2 23.25,18.2 33.7,18.2
  Top 0.75: 33.7,18.2 35.75,18.2 46.2,18.2 | 46.2,18.2 48.75,18.2 51.75,18.2 58.7,18.2 | 58.7,18.2 64.25,18.2 71.2,18.2 LED12.VDD | 1.5,82.9 1.5,82.8 | 58.7,5.7 64.5,5.7 71.2,5.7 LED6.VDD | 58.7,5.7 51.5,5.7 48.25,5.7 46.2,5.7 | 46.2,5.7 35.5,5.7 33.7,5.7 | 33.7,5.7 23.25,5.7 21.2,5.7 | 21.2,5.7 10.75,5.7 8.7,5.7 | 8.7,5.7 1.5,5.7 1.5,8.2 | LED19.VDD 83.7,30.7 | LED18.VDD 71.2,30.7 | LED17.VDD 58.7,30.7 | LED16.VDD 46.2,30.7 | LED15.VDD 33.7,30.7 | LED14.VDD 21.2,30.7 | LED13.VDD 8.7,30.7 | LED7.VDD 8.7,18.2 | LED8.VDD 21.2,18.2 | LED9.VDD 33.7,18.2 | LED10.VDD 46.2,18.2 | LED11.VDD 58.7,18.2 | LED5.VDD 58.7,5.7 | LED4.VDD 46.2,5.7 | LED3.VDD 33.7,5.7 | LED2.VDD 21.2,5.7 | LED1.VDD 8.7,5.7 | LED21.VDD 8.7,43.2 | LED22.VDD 21.2,43.2 | LED23.VDD 33.7,43.2 | LED24.VDD 46.2,43.2 | LED25.VDD 58.7,43.2 | LED26.VDD 71.2,43.2 | LED27.VDD 83.7,43.2 | LED35.VDD 83.7,55.7 | LED34.VDD 71.2,55.7 | LED33.VDD 58.7,55.7 | LED32.VDD 46.2,55.7 | LED31.VDD 33.7,55.7 | LED30.VDD 21.2,55.7 | LED29.VDD 8.7,55.7 | LED37.VDD 8.7,68.2 | LED38.VDD 21.2,68.2 | LED39.VDD 33.7,68.2 | LED40.VDD 46.2,68.2 | LED41.VDD 58.7,68.2 | LED42.VDD 71.2,68.2 | LED43.VDD 83.7,68.2 | LED51.VDD 83.7,80.7 | LED50.VDD 71.2,80.7 | LED49.VDD 58.7,80.7 | LED48.VDD 46.2,80.7 | LED47.VDD 33.7,80.7 | LED46.VDD 21.2,80.7 | LED45.VDD 8.7,80.7 | LED54.VDD 21.2,93.2 | LED55.VDD 33.7,93.2 | LED56.VDD 46.2,93.2 | LED57.VDD 58.7,93.2 | LED58.VDD 71.2,93.2 | LED59.VDD 83.7,93.2
  Top 1.5: 1.95,93.65 5.1,93.65 6.65,92.1 LED53.VDD
  Top 2: 1.5,8.2 1.5,18.2 1.5,30.7 1.5,43.2 1.5,50 | 1.5,50 1.5,55.7 1.5,68.2 1.5,80.7 1.5,82.8 1.5,93.2 1.95,93.65 | SV1.9 SV1.10 1.5,50